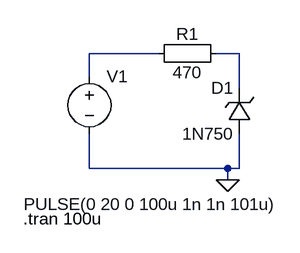
[diagram p0: schematic Zener Diode.asc]
Zener Diode.asc, the LTspice schematic file:
Version 4
SHEET 1 880 680
WIRE 144 80 48 80
WIRE 256 80 224 80
WIRE 48 112 48 80
WIRE 256 128 256 80
WIRE 48 240 48 192
WIRE 240 240 48 240
WIRE 256 240 256 192
WIRE 256 240 240 240
WIRE 240 256 240 240
FLAG 240 256 0
SYMBOL voltage 48 96 R0
WINDOW 3 -91 194 Left 2
WINDOW 123 0 0 Left 2
WINDOW 39 0 0 Left 2
SYMATTR InstName V1
SYMATTR Value PULSE(0 20 0 100u 1n 1n 101u)
SYMBOL Misc\\EuropeanResistor 240 64 R90
WINDOW 0 5 56 VBottom 2
WINDOW 3 27 56 VTop 2
SYMATTR InstName R1
SYMATTR Value 470
SYMBOL zener 272 192 R180
WINDOW 0 24 64 Left 2
WINDOW 3 24 0 Left 2
SYMATTR InstName D1
SYMATTR Value 1N750
SYMATTR Description Diode
SYMATTR Type diode
TEXT -44 310 Left 2 !.tran 100u

The netlist it stands for:
* Zener Diode.asc
V1 N001 0 PULSE(0 20 0 100u 1n 1n 101u)
R1 N002 N001 470
D1 0 N002 1N750
.model D D
.lib standard.dio
.tran 100u
.backanno
.end